# EAGLE design DAQBOARD (EAGLE 6.0)
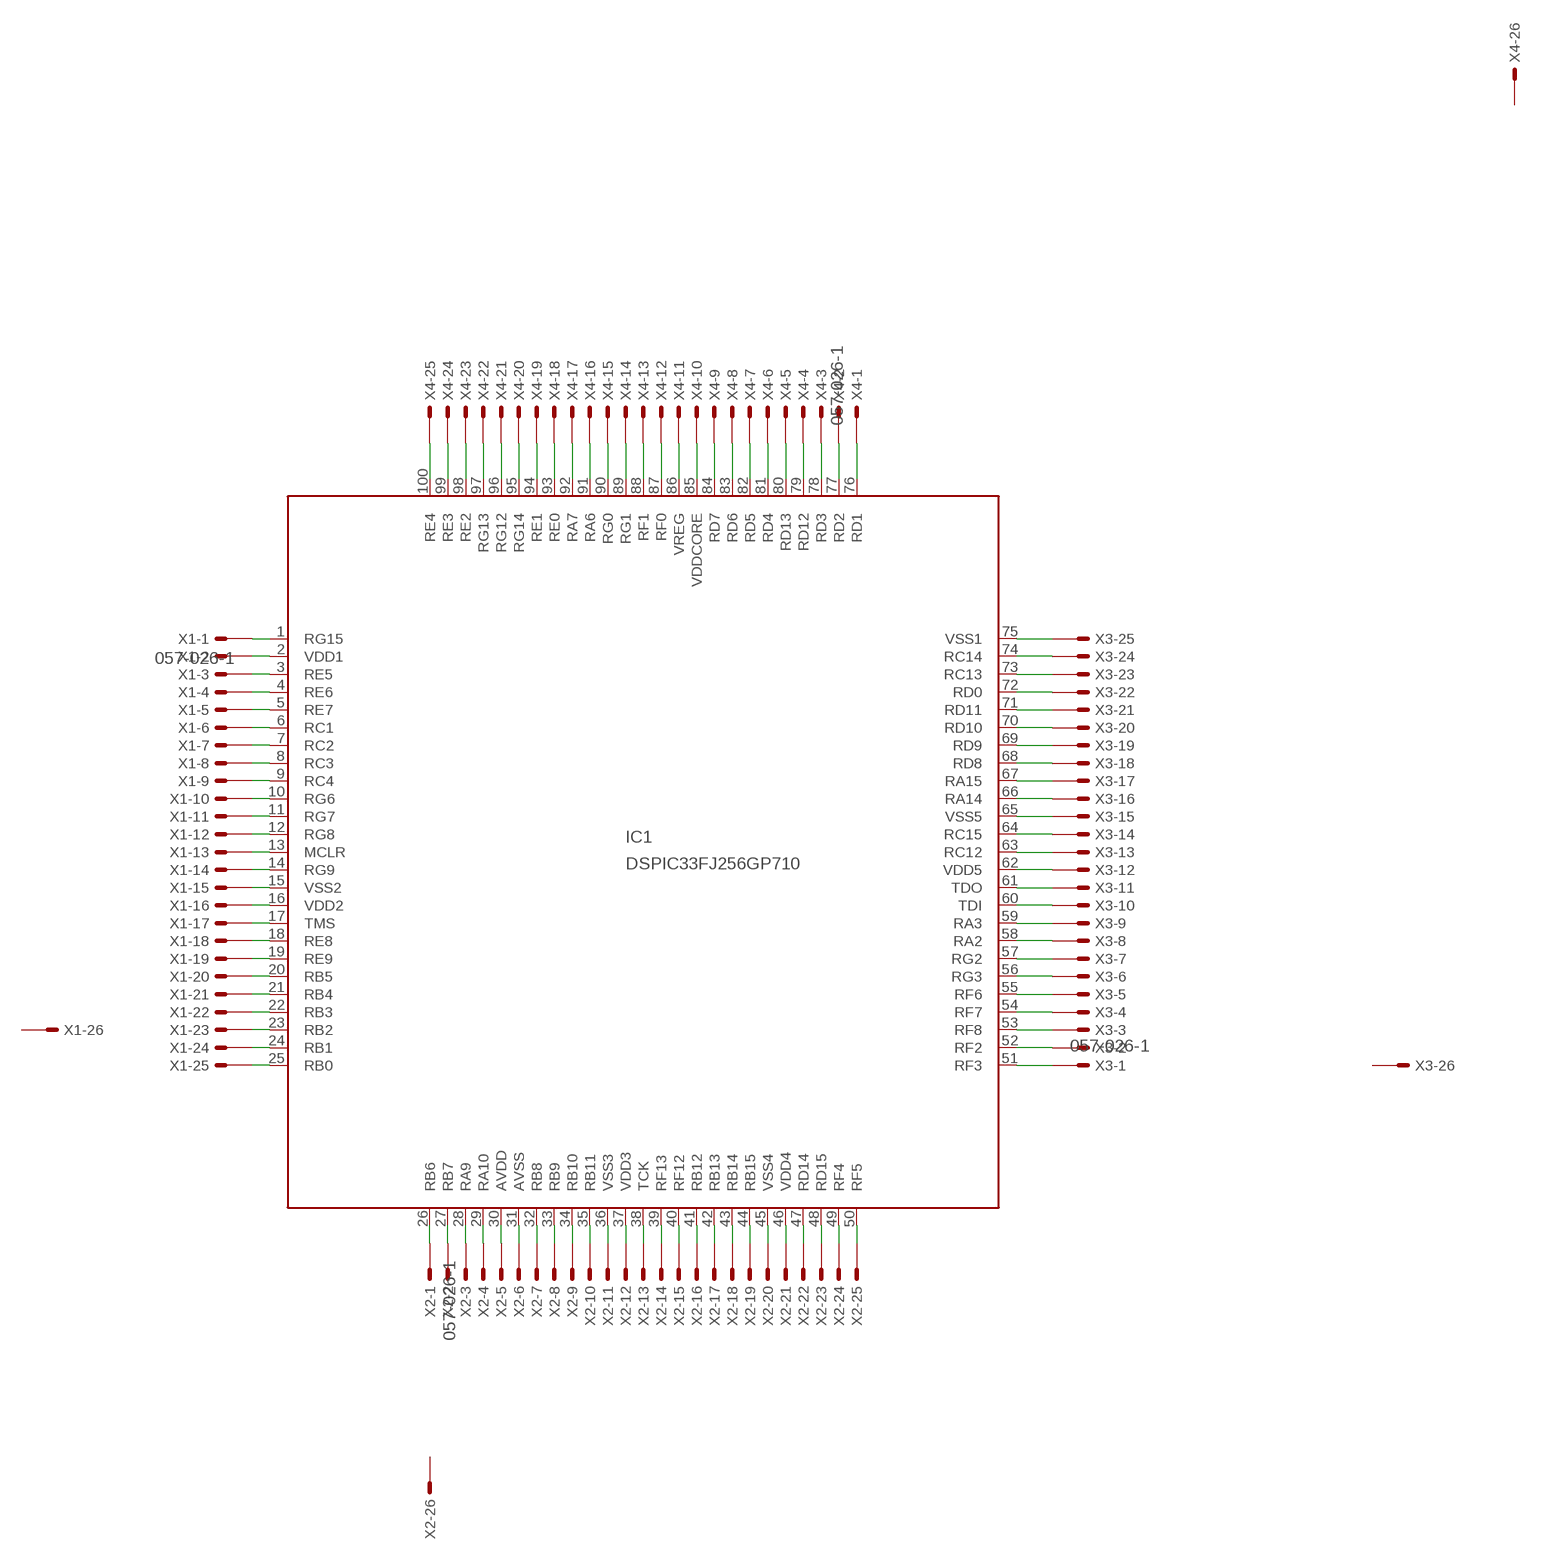
[diagram p0: schematic, sheet 1]

## Parts
IC1  DSPIC33FJ256GP710  [TQFP100-12X12]
X1  057-026-1  [057-026-1]
X2  057-026-1  [057-026-1]
X3  057-026-1  [057-026-1]
X4  057-026-1  [057-026-1]

## Nets
N$1: IC1.1(RG15) X1.1
N$2: IC1.2(VDD1) X1.2
N$3: IC1.3(RE5) X1.3
N$4: IC1.4(RE6) X1.4
N$5: IC1.5(RE7) X1.5
N$6: IC1.6(RC1) X1.6
N$7: IC1.7(RC2) X1.7
N$8: IC1.8(RC3) X1.8
N$9: IC1.9(RC4) X1.9
N$10: IC1.10(RG6) X1.10
N$11: IC1.11(RG7) X1.11
N$12: IC1.12(RG8) X1.12
N$13: IC1.13(MCLR) X1.13
N$14: IC1.14(RG9) X1.14
N$15: IC1.15(VSS2) X1.15
N$16: IC1.16(VDD2) X1.16
N$17: IC1.17(TMS) X1.17
N$18: IC1.18(RE8) X1.18
N$19: IC1.19(RE9) X1.19
N$20: IC1.20(RB5) X1.20
N$21: IC1.21(RB4) X1.21
N$22: IC1.22(RB3) X1.22
N$23: IC1.23(RB2) X1.23
N$24: IC1.24(RB1) X1.24
N$25: IC1.25(RB0) X1.25
N$26: IC1.26(RB6) X2.1
N$27: IC1.27(RB7) X2.2
N$28: IC1.28(RA9) X2.3
N$29: IC1.29(RA10) X2.4
N$30: IC1.30(AVDD) X2.5
N$31: IC1.31(AVSS) X2.6
N$32: IC1.32(RB8) X2.7
N$33: IC1.33(RB9) X2.8
N$34: IC1.34(RB10) X2.9
N$35: IC1.35(RB11) X2.10
N$36: IC1.36(VSS3) X2.11
N$37: IC1.37(VDD3) X2.12
N$38: IC1.38(TCK) X2.13
N$39: IC1.39(RF13) X2.14
N$40: IC1.40(RF12) X2.15
N$41: IC1.41(RB12) X2.16
N$42: IC1.42(RB13) X2.17
N$43: IC1.43(RB14) X2.18
N$44: IC1.44(RB15) X2.19
N$45: IC1.45(VSS4) X2.20
N$46: IC1.46(VDD4) X2.21
N$47: IC1.47(RD14) X2.22
N$48: IC1.48(RD15) X2.23
N$49: IC1.49(RF4) X2.24
N$50: IC1.50(RF5) X2.25
N$51: IC1.51(RF3) X3.1
N$52: IC1.52(RF2) X3.2
N$53: IC1.53(RF8) X3.3
N$54: IC1.54(RF7) X3.4
N$55: IC1.55(RF6) X3.5
N$56: IC1.56(RG3) X3.6
N$57: IC1.57(RG2) X3.7
N$58: IC1.58(RA2) X3.8
N$59: IC1.59(RA3) X3.9
N$60: IC1.60(TDI) X3.10
N$61: IC1.61(TDO) X3.11
N$62: IC1.62(VDD5) X3.12
N$63: IC1.63(RC12) X3.13
N$64: IC1.64(RC15) X3.14
N$65: IC1.65(VSS5) X3.15
N$66: IC1.66(RA14) X3.16
N$67: IC1.67(RA15) X3.17
N$68: IC1.68(RD8) X3.18
N$69: IC1.69(RD9) X3.19
N$70: IC1.70(RD10) X3.20
N$71: IC1.71(RD11) X3.21
N$72: IC1.72(RD0) X3.22
N$73: IC1.73(RC13) X3.23
N$74: IC1.74(RC14) X3.24
N$75: IC1.75(VSS1) X3.25
N$76: IC1.76(RD1) X4.1
N$77: IC1.77(RD2) X4.2
N$78: IC1.78(RD3) X4.3
N$79: IC1.79(RD12) X4.4
N$80: IC1.80(RD13) X4.5
N$81: IC1.81(RD4) X4.6
N$82: IC1.82(RD5) X4.7
N$83: IC1.83(RD6) X4.8
N$84: IC1.84(RD7) X4.9
N$85: IC1.85(VDDCORE) X4.10
N$86: IC1.86(VREG) X4.11
N$87: IC1.87(RF0) X4.12
N$88: IC1.88(RF1) X4.13
N$89: IC1.89(RG1) X4.14
N$90: IC1.90(RG0) X4.15
N$91: IC1.91(RA6) X4.16
N$92: IC1.92(RA7) X4.17
N$93: IC1.93(RE0) X4.18
N$94: IC1.94(RE1) X4.19
N$95: IC1.95(RG14) X4.20
N$96: IC1.96(RG12) X4.21
N$97: IC1.97(RG13) X4.22
N$98: IC1.98(RE2) X4.23
N$99: IC1.99(RE3) X4.24
N$100: IC1.100(RE4) X4.25
Unconnected: X1.26 X2.26 X3.26 X4.26

## Library data of the parts
IC1 = microchip:DSPIC33FJ256GP710: dsPIC33FJ256GP710_TQFP edit this description Auto generated by make-symbol-device-package-bsdl.ulp Rev. 41 Source: dsPIC33FJ256GP710_TQFP.bsd
X1-X4 = con-panduit:057-026-: CONNECTOR 20-pin series 057 contact pc board low profile headers; OC_FARNELL: unknown; OC_NEWARK: unknown

## Board
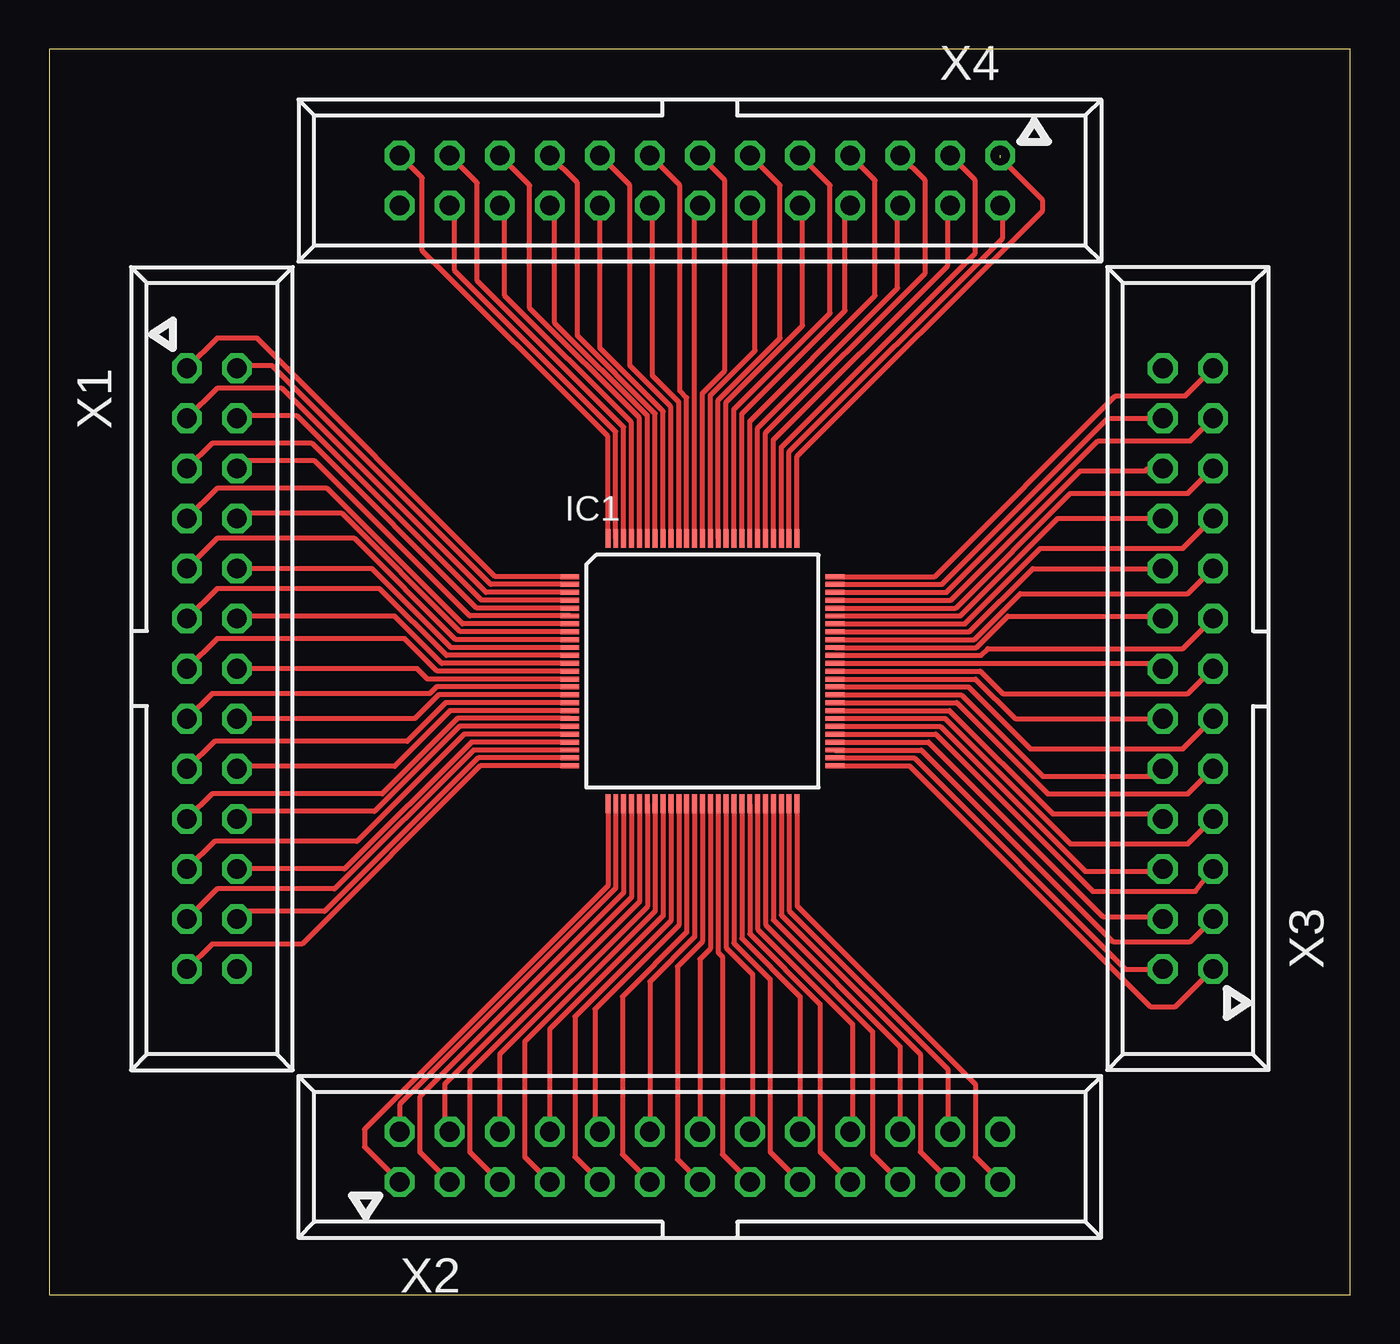
[diagram p1: board, top side]

Size 66.02 x 63.17 mm. Coordinates in mm from the lower left corner, seen from the top.
Outline: 0,0 66.02,0 66.02,63.17 0,63.17 0,0
Copper layers (1*16): Top 0.035mm / dielectric 1.5mm / Bottom 0.035mm
Design rules: minimum track width 8mil, minimum drill 24mil, track to track 4mil, track to pad 4mil, pad to pad 4mil, via to via 4mil, smd to smd 8mil, copper to edge 40mil, drill to drill 8mil, minimum pad ring 10mil, minimum via ring 8mil, stop-mask expansion 4mil, vias tented up to drill 0mil, thermal gap 10mil

### Footprints (pad centres in the part's own frame; a part is rotated, then mirrored left to right if it is on the bottom)
TQFP100-12X12 = smd 0.95 x 0.25: 1 -6.725,4.8; 2 -6.725,4.4; 3 -6.725,4; 4 -6.725,3.6; 5 -6.725,3.2; 6 -6.725,2.8; 7 -6.725,2.4; 8 -6.725,2; 9 -6.725,1.6; 10 -6.725,1.2; 11 -6.725,0.8; 12 -6.725,0.4; 13 -6.725,0; 14 -6.725,-0.4; 15 -6.725,-0.8; 16 -6.725,-1.2; 17 -6.725,-1.6; 18 -6.725,-2; 19 -6.725,-2.4; 20 -6.725,-2.8; 21 -6.725,-3.2; 22 -6.725,-3.6; 23 -6.725,-4; 24 -6.725,-4.4; 25 -6.725,-4.8; 51 6.725,-4.8; 52 6.725,-4.4; 53 6.725,-4; 54 6.725,-3.6; 55 6.725,-3.2; 56 6.725,-2.8; 57 6.725,-2.4; 58 6.725,-2; 59 6.725,-1.6; 60 6.725,-1.2; 61 6.725,-0.8; 62 6.725,-0.4; 63 6.725,0; 64 6.725,0.4; 65 6.725,0.8; 66 6.725,1.2; 67 6.725,1.6; 68 6.725,2; 69 6.725,2.4; 70 6.725,2.8; 71 6.725,3.2; 72 6.725,3.6; 73 6.725,4; 74 6.725,4.4; 75 6.725,4.8 | smd 0.25 x 0.95: 26 -4.8,-6.725; 27 -4.4,-6.725; 28 -4,-6.725; 29 -3.6,-6.725; 30 -3.2,-6.725; 31 -2.8,-6.725; 32 -2.4,-6.725; 33 -2,-6.725; 34 -1.6,-6.725; 35 -1.2,-6.725; 36 -0.8,-6.725; 37 -0.4,-6.725; 38 0,-6.725; 39 0.4,-6.725; 40 0.8,-6.725; 41 1.2,-6.725; 42 1.6,-6.725; 43 2,-6.725; 44 2.4,-6.725; 45 2.8,-6.725; 46 3.2,-6.725; 47 3.6,-6.725; 48 4,-6.725; 49 4.4,-6.725; 50 4.8,-6.725; 76 4.8,6.725; 77 4.4,6.725; 78 4,6.725; 79 3.6,6.725; 80 3.2,6.725; 81 2.8,6.725; 82 2.4,6.725; 83 2,6.725; 84 1.6,6.725; 85 1.2,6.725; 86 0.8,6.725; 87 0.4,6.725; 88 0,6.725; 89 -0.4,6.725; 90 -0.8,6.725; 91 -1.2,6.725; 92 -1.6,6.725; 93 -2,6.725; 94 -2.4,6.725; 95 -2.8,6.725; 96 -3.2,6.725; 97 -3.6,6.725; 98 -4,6.725; 99 -4.4,6.725; 100 -4.8,6.725
057-026-1 = drill 1 octagon: 1 -15.24,-1.27; 2 -15.24,1.27; 3 -12.7,-1.27; 4 -12.7,1.27; 5 -10.16,-1.27; 6 -10.16,1.27; 7 -7.62,-1.27; 8 -7.62,1.27; 9 -5.08,-1.27; 10 -5.08,1.27; 11 -2.54,-1.27; 12 -2.54,1.27; 13 0,-1.27; 14 0,1.27; 15 2.54,-1.27; 16 2.54,1.27; 17 5.08,-1.27; 18 5.08,1.27; 19 7.62,-1.27; 20 7.62,1.27; 21 10.16,-1.27; 22 10.16,1.27; 23 12.7,-1.27; 24 12.7,1.27; 25 15.24,-1.27; 26 15.24,1.27

### Placement (x,y rotation side)
IC1  33.15,31.62 0 top
X1  8.26,31.75 270 top
X2  33.02,6.98 0 top
X3  57.79,31.75 90 top
X4  33.02,56.51 180 top

### Tracks (layer width: path | path; a pad name or v marks a point on that pad's centre or on a via)
N$1
  Top 0.254: IC1.1 22.63,36.42 10.54,48.51 8.51,48.51 X1.1
N$2
  Top 0.254: IC1.2 22.4,36.02 11.3,47.12 9.65,47.12 X1.2
N$3
  Top 0.254: IC1.3 22.16,35.62 11.81,45.97 8.51,45.97 X1.3
N$4
  Top 0.254: IC1.4 21.93,35.22 12.57,44.58 9.65,44.58 X1.4
N$5
  Top 0.254: IC1.5 21.69,34.82 13.34,43.18 8.26,43.18 X1.5
N$6
  Top 0.254: IC1.6 21.33,34.42 13.46,42.29 9.91,42.29 X1.6
N$7
  Top 0.254: IC1.7 20.97,34.02 14.1,40.89 8.51,40.89 X1.7
N$8
  Top 0.254: IC1.8 20.86,33.62 14.86,39.62 9.78,39.62 X1.8
N$9
  Top 0.254: IC1.9 20.63,33.22 15.49,38.35 8.51,38.35 X1.9
N$10
  Top 0.254: IC1.10 20.39,32.82 16.38,36.83 X1.10
N$11
  Top 0.254: IC1.11 20.16,32.42 16.76,35.81 8.51,35.81 X1.11
N$12
  Top 0.254: IC1.12 19.92,32.02 17.53,34.42 9.65,34.42 X1.12
N$13
  Top 0.254: IC1.13 19.69,31.62 18.03,33.27 8.51,33.27 X1.13
N$14
  Top 0.254: IC1.14 19.2,31.22 18.67,31.75 X1.14 | X1.14 9.4,31.75 9.27,31.88 9.4,31.88 X1.14
N$15
  Top 0.254: IC1.15 19.65,30.82 19.3,30.48 8.26,30.48 X1.15
N$16
  Top 0.254: IC1.16 19.76,30.42 18.54,29.21 X1.16
N$17
  Top 0.254: IC1.17 20.12,30.02 18.16,28.07 8.38,28.07 X1.17
N$18
  Top 0.254: IC1.18 20.35,29.62 17.53,26.8 9.65,26.8 X1.18
N$19
  Top 0.254: IC1.19 20.71,29.22 16.89,25.4 8.26,25.4 X1.19
N$20
  Top 0.254: IC1.20 20.82,28.82 16.51,24.51 9.91,24.51 X1.20
N$21
  Top 0.254: IC1.21 21.06,28.42 15.62,22.99 8.38,22.99 X1.21
N$22
  Top 0.254: IC1.22 21.42,28.02 14.99,21.59 X1.22
N$23
  Top 0.254: IC1.23 21.53,27.62 14.48,20.57 8.51,20.57 X1.23
N$24
  Top 0.254: IC1.24 21.76,27.22 13.97,19.43 9.91,19.43 X1.24
N$25
  Top 0.254: IC1.25 21.87,26.82 12.83,17.78 8.26,17.78 X1.25
N$26
  Top 0.254: IC1.26 28.35,20.73 16,8.38 16,7.49 X2.1
N$27
  Top 0.254: IC1.27 28.75,20.62 17.78,9.65 X2.2
N$28
  Top 0.254: IC1.28 29.15,20.38 18.8,10.03 18.8,7.24 X2.3
N$29
  Top 0.254: IC1.29 29.55,20.15 20.07,10.67 20.07,8.51 X2.4
N$30
  Top 0.254: IC1.30 29.95,19.91 21.34,11.3 21.34,7.24 X2.5
N$31
  Top 0.254: IC1.31 30.35,19.68 22.86,12.19 X2.6
N$32
  Top 0.254: IC1.32 30.75,19.44 24.13,12.83 24.13,6.98 X2.7
N$33
  Top 0.254: IC1.33 31.15,19.21 25.4,13.46 X2.8
N$34
  Top 0.254: IC1.34 31.55,18.97 26.67,14.1 26.67,6.98 X2.9
N$35
  Top 0.254: IC1.35 31.95,18.74 27.69,14.48 27.69,8.51 X2.10
N$36
  Top 0.254: IC1.36 32.35,18.38 29.08,15.11 29.08,7.11 X2.11
N$37
  Top 0.254: IC1.37 32.75,18.14 30.48,15.88 X2.12
N$38
  Top 0.254: IC1.38 33.15,17.91 31.88,16.64 31.88,6.86 X2.13
N$39
  Top 0.254: IC1.39 33.55,17.55 33.02,17.02 X2.14
N$40
  Top 0.254: IC1.40 33.95,17.36 34.16,17.15 34.16,7.11 X2.15
N$41
  Top 0.254: IC1.41 34.35,17.6 35.69,16.26 35.69,8.38 X2.16
N$42
  Top 0.254: IC1.42 34.75,17.83 36.58,16 36.58,7.24 X2.17
N$43
  Top 0.254: IC1.43 35.15,18.07 38.1,15.11 X2.18
N$44
  Top 0.254: IC1.44 35.55,18.3 39.12,14.73 39.12,7.24 X2.19
N$45
  Top 0.254: IC1.45 35.95,18.54 40.77,13.72 40.77,8.38 X2.20
N$46
  Top 0.254: IC1.46 36.35,18.77 41.78,13.34 41.78,7.11 X2.21
N$47
  Top 0.254: IC1.47 36.75,19.01 43.18,12.57 X2.22
N$48
  Top 0.254: IC1.48 37.15,19.24 44.2,12.19 44.2,7.24 X2.23
N$49
  Top 0.254: IC1.49 37.55,19.48 45.59,11.43 45.59,8.38 X2.24
N$50
  Top 0.254: IC1.50 37.95,19.71 46.99,10.67 46.99,6.98 X2.25
N$51
  Top 0.254: IC1.51 43.66,26.82 55.88,14.6 57.15,14.6 X3.1
N$52
  Top 0.254: IC1.52 43.9,27.22 54.61,16.51 X3.2
N$53
  Top 0.254: IC1.53 44.26,27.62 53.98,17.91 57.91,17.91 X3.3
N$54
  Top 0.254: IC1.54 44.62,28.02 53.47,19.18 56.39,19.18 X3.4
N$55
  Top 0.254: IC1.55 44.98,28.42 52.96,20.45 58.17,20.45 X3.5
N$56
  Top 0.254: IC1.56 45.22,28.82 52.58,21.46 56.39,21.46 X3.6
N$57
  Top 0.254: IC1.57 45.45,29.22 51.82,22.86 57.79,22.86 X3.7
N$58
  Top 0.254: IC1.58 45.69,29.62 50.93,24.38 56.26,24.38 X3.8
N$59
  Top 0.254: IC1.59 46.05,30.02 50.67,25.4 57.79,25.4 X3.9
N$60
  Top 0.254: IC1.60 46.29,30.42 50.42,26.29 56.13,26.29 X3.10
N$61
  Top 0.254: IC1.61 46.65,30.82 49.78,27.69 57.53,27.69 X3.11
N$62
  Top 0.254: IC1.62 47.01,31.22 49.02,29.21 X3.12
N$63
  Top 0.254: IC1.63 47.24,31.62 48.39,30.48 57.79,30.48 X3.13
N$64
  Top 0.254: IC1.64 56.24,32.02 X3.14
N$65
  Top 0.254: IC1.65 47.28,32.42 47.63,32.77 57.53,32.77 X3.15
N$66
  Top 0.254: IC1.66 47.05,32.82 48.64,34.42 56.39,34.42 X3.16
N$67
  Top 0.254: IC1.67 46.94,33.22 49.28,35.56 57.79,35.56 X3.17
N$68
  Top 0.254: IC1.68 46.7,33.62 49.91,36.83 X3.18
N$69
  Top 0.254: IC1.69 46.47,34.02 50.29,37.85 57.53,37.85 X3.19
N$70
  Top 0.254: IC1.70 46.23,34.42 51.18,39.37 X3.20
N$71
  Top 0.254: IC1.71 46,34.82 51.82,40.64 57.79,40.64 X3.21
N$72
  Top 0.254: IC1.72 45.76,35.22 52.32,41.78 55.63,41.78 55.75,41.91 X3.22
N$73
  Top 0.254: IC1.73 45.53,35.62 53.21,43.31 57.91,43.31 X3.23
N$74
  Top 0.254: IC1.74 45.29,36.02 53.72,44.45 X3.24
N$75
  Top 0.254: IC1.75 44.93,36.42 54.1,45.59 57.66,45.59 X3.25
N$76  (1 unrouted)
  Top 0.254: IC1.76 37.95,42.52 50.42,54.99 50.42,55.5 48.26,57.66
N$77
  Top 0.254: IC1.77 37.55,42.75 48.39,53.59 48.39,55.12 X4.2
N$78
  Top 0.254: IC1.78 37.15,42.99 46.99,52.83 46.99,56.51 X4.3
N$79
  Top 0.254: IC1.79 36.75,43.35 45.59,52.2 45.59,55.12 X4.4
N$80
  Top 0.254: IC1.80 36.35,43.71 44.45,51.82 44.45,56.51 X4.5
N$81
  Top 0.254: IC1.81 35.95,43.95 43.05,51.05 43.05,55.12 X4.6
N$82
  Top 0.254: IC1.82 35.55,44.31 41.91,50.67 41.91,56.51 X4.7
N$83
  Top 0.254: IC1.83 35.15,44.67 40.39,49.91 40.39,54.99 X4.8
N$84
  Top 0.254: IC1.84 34.75,44.91 39.62,49.78 39.62,56.26 X4.9
N$85
  Top 0.254: IC1.85 34.35,45.27 38.23,49.15 38.23,55.12 X4.10
N$86
  Top 0.254: IC1.86 33.95,45.38 37.08,48.51 37.08,56.26 X4.11
N$87
  Top 0.254: IC1.87 33.55,45.61 35.81,47.88 35.81,54.99 X4.12
N$88
  Top 0.254: IC1.88 33.15,45.72 34.29,46.86 34.29,56.51 X4.13
N$89
  Top 0.254: IC1.89 32.75,54.97 X4.14
N$90
  Top 0.254: IC1.90 32.35,45.5 32,45.85 32,56.26 X4.15
N$91
  Top 0.254: IC1.91 31.95,45.27 30.61,46.61 30.61,55.12 X4.16
N$92
  Top 0.254: IC1.92 31.55,45.03 29.46,47.12 29.46,56.26 X4.17
N$93
  Top 0.254: IC1.93 31.15,44.8 27.94,48.01 X4.18
N$94
  Top 0.254: IC1.94 30.75,44.69 26.8,48.64 26.8,56.39 X4.19
N$95
  Top 0.254: IC1.95 30.35,44.58 25.65,49.28 25.65,54.99 X4.20
N$96
  Top 0.254: IC1.96 29.95,44.48 24.38,50.04 24.38,56.26 X4.21
N$97
  Top 0.254: IC1.97 29.55,44.24 23.11,50.67 23.11,54.99 X4.22
N$98
  Top 0.254: IC1.98 29.15,44.01 21.72,51.43 21.72,56.39 X4.23
N$99
  Top 0.254: IC1.99 28.75,43.77 20.57,51.94 20.57,54.99 X4.24
N$100
  Top 0.254: IC1.100 28.35,43.53 18.92,52.96 18.92,56.64 X4.25